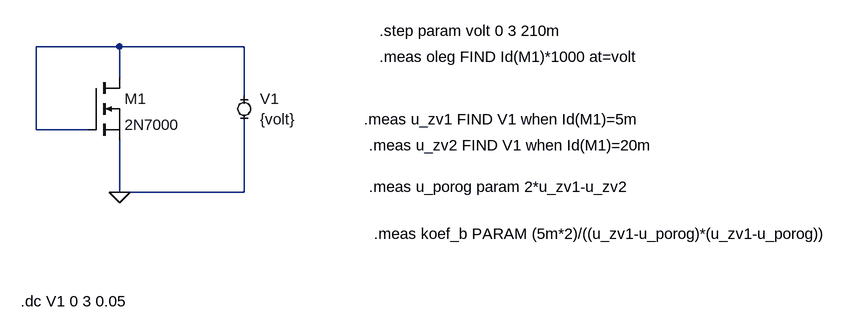
[diagram p0: schematic Ic(Uzv).asc]
Ic(Uzv).asc, the LTspice schematic file:
Version 4
SHEET 1 1388 680
WIRE 256 64 128 64
WIRE 448 64 256 64
WIRE 256 112 256 64
WIRE 448 144 448 64
WIRE 128 192 128 64
WIRE 208 192 128 192
WIRE 256 288 256 208
WIRE 448 288 448 176
WIRE 448 288 256 288
FLAG 256 288 0
SYMBOL MiniSyms4\\voltage- 448 160 R0
WINDOW 123 0 0 Left 2
WINDOW 39 0 0 Left 2
SYMATTR InstName V1
SYMATTR Value {volt}
SYMBOL nmos 208 112 R0
SYMATTR InstName M1
SYMATTR Value 2N7000
TEXT 104 456 Left 2 !.dc V1 0 3 0.05
TEXT 656 80 Left 2 !.meas oleg FIND Id(M1)*1000 at=volt
TEXT 656 40 Left 2 !.step param volt 0 3 210m
TEXT 632 176 Left 2 !.meas u_zv1 FIND V1 when Id(M1)=5m
TEXT 640 216 Left 2 !.meas u_zv2 FIND V1 when Id(M1)=20m
TEXT 640 280 Left 2 !.meas u_porog param 2*u_zv1-u_zv2
TEXT 648 352 Left 2 !.meas koef_b PARAM (5m*2)/((u_zv1-u_porog)*(u_zv1-u_porog))

The netlist it stands for:
* Ic(Uzv).asc
V1 N001 0 {volt}
M1 N001 N001 0 0 2N7000
.model NMOS NMOS
.model PMOS PMOS
.lib standard.mos
.dc V1 0 3 0.05
.meas oleg FIND Id(M1)*1000 at=volt
.step param volt 0 3 210m
.meas u_zv1 FIND V1 when Id(M1)=5m
.meas u_zv2 FIND V1 when Id(M1)=20m
.meas u_porog param 2*u_zv1-u_zv2
.meas koef_b PARAM (5m*2)/((u_zv1-u_porog)*(u_zv1-u_porog))
.backanno
.end